# EAGLE design keyboard_s (EAGLE 7.2.0)
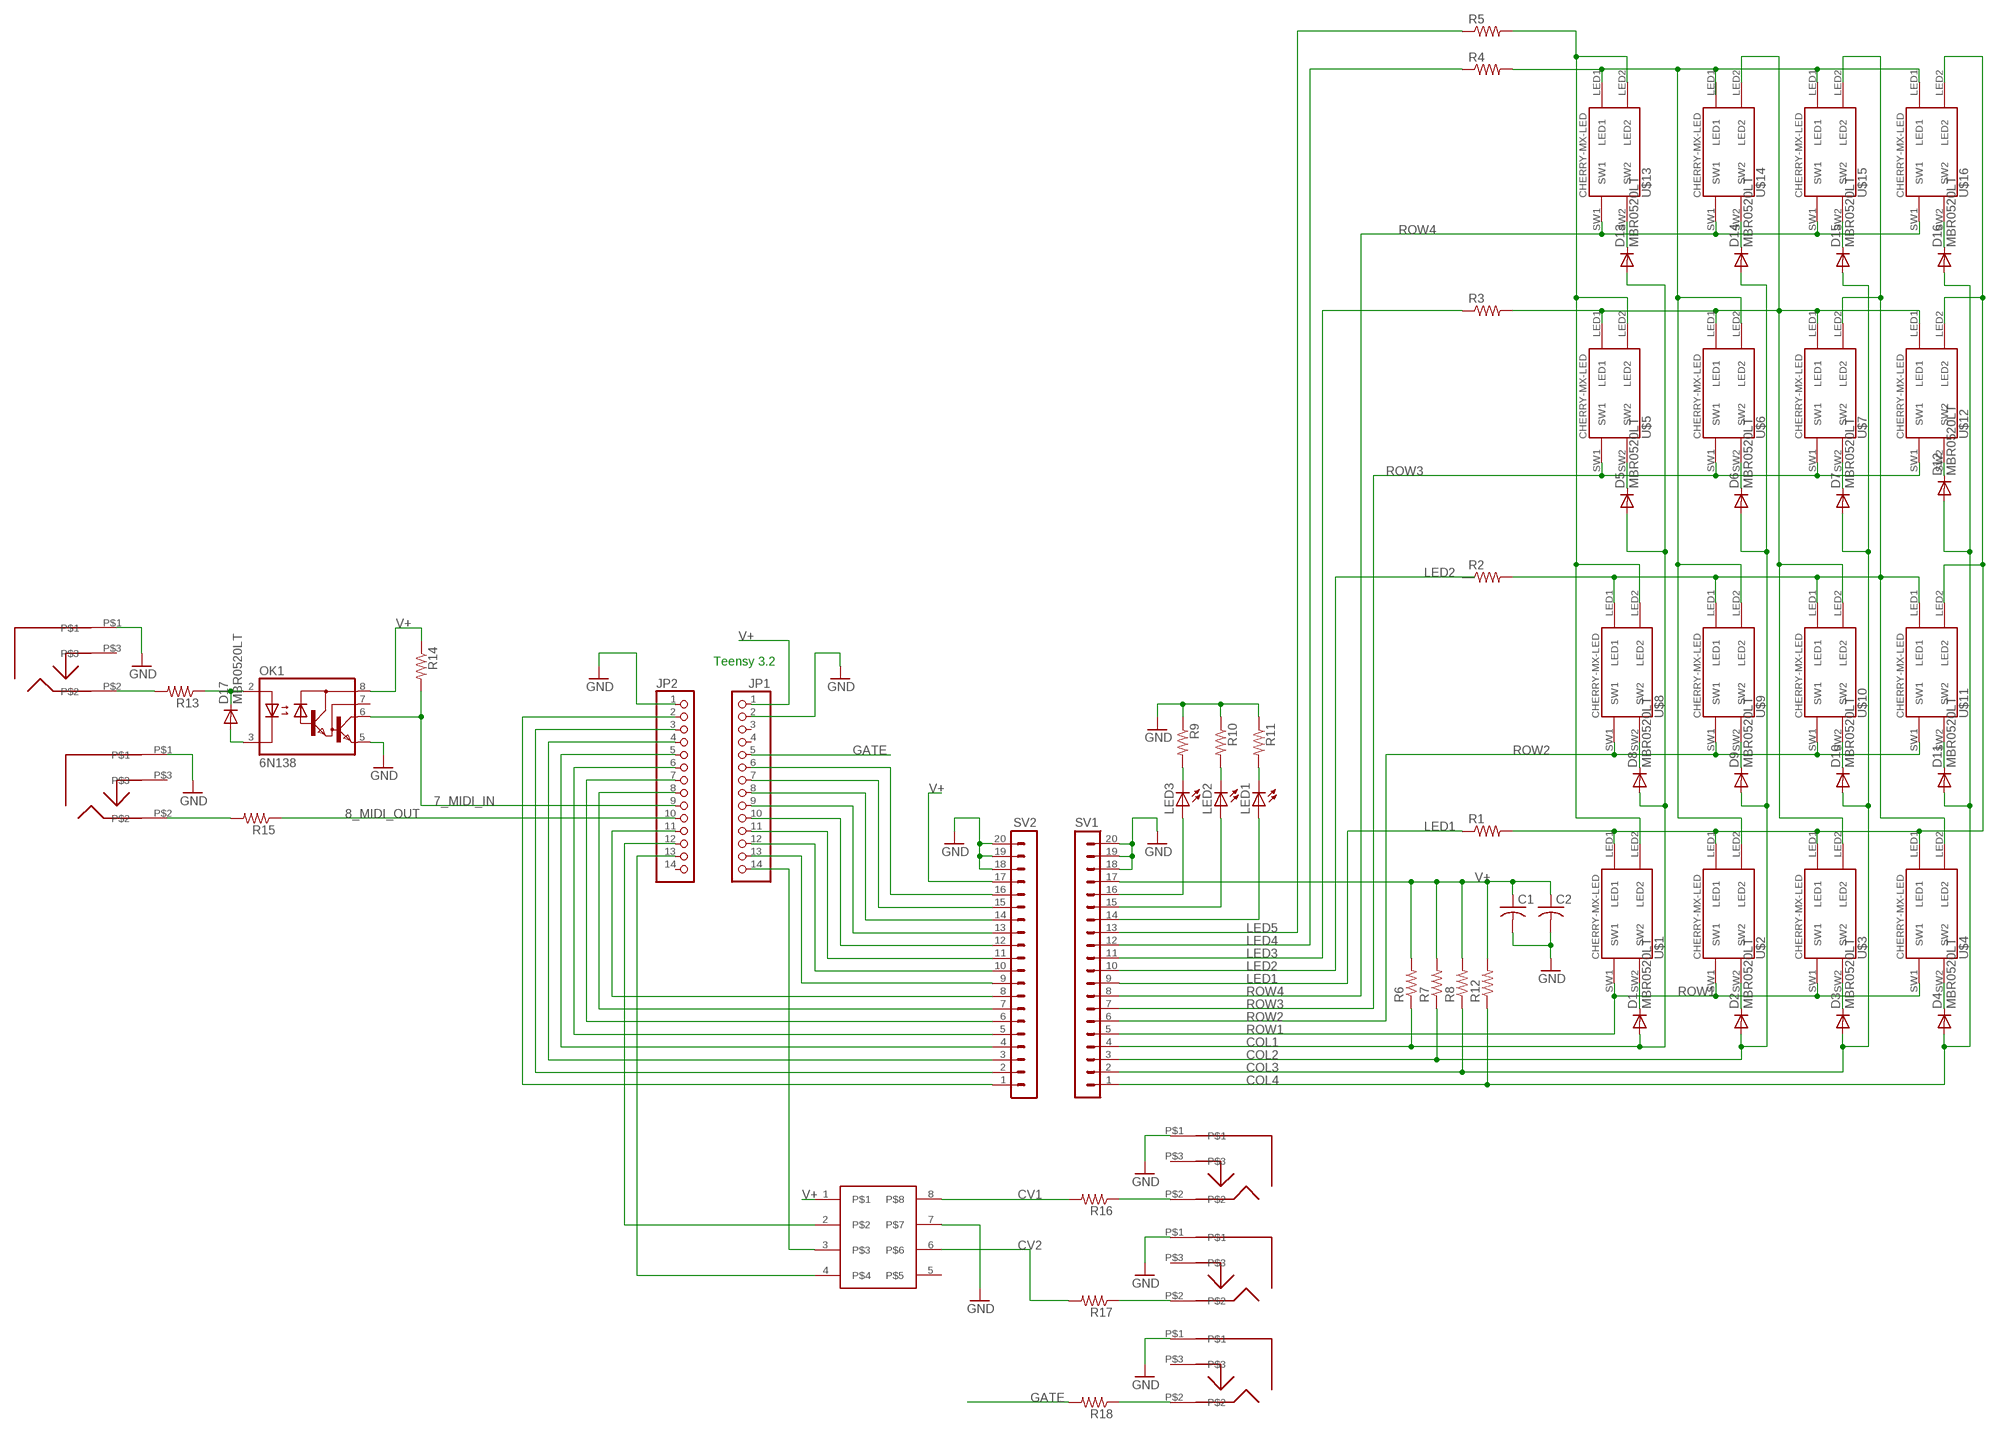
[diagram p0: schematic, sheet 1]

## Parts
C1  C-USC0603  [C0603]
C2  C-USC0603  [C0603]
D1  MBR0520LT  [SOD123]
D2  MBR0520LT  [SOD123]
D3  MBR0520LT  [SOD123]
D4  MBR0520LT  [SOD123]
D5  MBR0520LT  [SOD123]
D6  MBR0520LT  [SOD123]
D7  MBR0520LT  [SOD123]
D8  MBR0520LT  [SOD123]
D9  MBR0520LT  [SOD123]
D10  MBR0520LT  [SOD123]
D11  MBR0520LT  [SOD123]
D12  MBR0520LT  [SOD123]
D13  MBR0520LT  [SOD123]
D14  MBR0520LT  [SOD123]
D15  MBR0520LT  [SOD123]
D16  MBR0520LT  [SOD123]
D17  MBR0520LT  [SOD123]
JP1  PINHD-1X14  [1X14]
JP2  PINHD-1X14  [1X14]
LED1  LED5MM  [LED5MM]
LED2  LED5MM  [LED5MM]
LED3  LED5MM  [LED5MM]
OK1  6N138  [DIL08]
R1  R-US_R0603  [R0603]
R2  R-US_R0603  [R0603]
R3  R-US_R0603  [R0603]
R4  R-US_R0603  [R0603]
R5  R-US_R0603  [R0603]
R6  R-US_R0603  [R0603]
R7  R-US_R0603  [R0603]
R8  R-US_R0603  [R0603]
R9  R-US_R0603  [R0603]
R10  R-US_R0603  [R0603]
R11  R-US_R0603  [R0603]
R12  R-US_R0603  [R0603]
R13  R-US_R0603  [R0603]
R14  R-US_R0603  [R0603]
R15  R-US_R0603  [R0603]
R16  R-US_R0603  [R0603]
R17  R-US_R0603  [R0603]
R18  R-US_R0603  [R0603]
SV1  MA20-1  [MA20-1]
SV2  MA20-1  [MA20-1]
U$1  CHERRY-MX-LED  [CHERRY-MX-LED]
U$2  CHERRY-MX-LED  [CHERRY-MX-LED]
U$3  CHERRY-MX-LED  [CHERRY-MX-LED]
U$4  CHERRY-MX-LED  [CHERRY-MX-LED]
U$5  CHERRY-MX-LED  [CHERRY-MX-LED]
U$6  CHERRY-MX-LED  [CHERRY-MX-LED]
U$7  CHERRY-MX-LED  [CHERRY-MX-LED]
U$8  CHERRY-MX-LED  [CHERRY-MX-LED]
U$9  CHERRY-MX-LED  [CHERRY-MX-LED]
U$10  CHERRY-MX-LED  [CHERRY-MX-LED]
U$11  CHERRY-MX-LED  [CHERRY-MX-LED]
U$12  CHERRY-MX-LED  [CHERRY-MX-LED]
U$13  CHERRY-MX-LED  [CHERRY-MX-LED]
U$14  CHERRY-MX-LED  [CHERRY-MX-LED]
U$15  CHERRY-MX-LED  [CHERRY-MX-LED]
U$16  CHERRY-MX-LED  [CHERRY-MX-LED]
U$17  MCP4822  [SO08]
U$18  MJ3536N  [MJ3536N]
U$19  MJ3536N  [MJ3536N]
U$20  MJ3536N  [MJ3536N]
U$21  MJ3536N  [MJ3536N]
U$22  MJ3536N  [MJ3536N]

## Nets
7_MIDI_IN: JP2.9 OK1.6(VO) R14.2
8_MIDI_OUT: JP2.10 R15.1
COL1: D1.A D5.A D8.A D13.A R6.1 SV1.4
COL2: D2.A D6.A D9.A D14.A R7.1 SV1.3
COL3: D3.A D7.A D10.A D15.A R8.1 SV1.2
COL4: D4.A D11.A D12.A D16.A R12.1 SV1.1
CV1: R16.2 U$17.8
CV2: R17.2 U$17.6
GATE: JP1.5 R18.2
GND: C1.2 C2.2 JP1.2 JP2.1 OK1.5(GND) R9.1 R10.1 R11.1 SV1.18 SV1.19 SV1.20 SV2.18 SV2.19 SV2.20 U$17.7 U$18.P$1 U$19.P$1 U$20.P$1 U$21.P$1 U$22.P$1
LED1: R1.1 SV1.9
LED2: R2.1 SV1.10
LED3: R3.1 SV1.11
LED4: R4.1 SV1.12
LED5: R5.1 SV1.13
N$1: D8.C U$8.SW2
N$2: D9.C U$9.SW2
N$3: D10.C U$10.SW2
N$4: D11.C U$11.SW2
N$5: D12.C U$12.SW2
N$6: D13.C U$13.SW2
N$7: D14.C U$14.SW2
N$8: D7.C U$7.SW2
N$9: D6.C U$6.SW2
N$10: D5.C U$5.SW2
N$11: D4.C U$4.SW2
N$12: D3.C U$3.SW2
N$13: D2.C U$2.SW2
N$14: D1.C U$1.SW2
N$15: D15.C U$15.SW2
N$16: D16.C U$16.SW2
N$17: LED1.A SV1.14
N$18: D17.C OK1.2(A) R13.1
N$19: R1.2 U$1.LED1 U$2.LED1 U$3.LED1 U$4.LED1 U$11.LED2 U$12.LED2 U$16.LED2
N$20: D17.A OK1.3(C)
N$21: LED2.A SV1.15
N$22: LED3.A SV1.16
N$23: R13.2 U$18.P$2
N$24: JP1.14 U$17.3
N$25: JP2.13 U$17.4
N$26: JP2.12 U$17.2
N$27: JP2.2 SV2.1
N$28: JP2.3 SV2.2
N$29: JP2.4 SV2.3
N$30: JP2.5 SV2.4
N$31: JP2.6 SV2.5
N$32: JP2.7 SV2.6
N$33: JP2.8 SV2.7
N$34: JP2.11 SV2.8
N$35: JP1.13 SV2.9
N$36: JP1.12 SV2.10
N$37: JP1.11 SV2.11
N$38: JP1.10 SV2.12
N$39: JP1.9 SV2.13
N$40: JP1.8 SV2.14
N$41: JP1.7 SV2.15
N$42: JP1.6 SV2.16
N$43: R15.2 U$19.P$2
N$44: R16.1 U$20.P$2
N$45: R17.1 U$21.P$2
N$46: R18.1 U$22.P$2
N$48: LED1.K(C) R11.2
N$50: R3.2 U$3.LED2 U$5.LED1 U$6.LED1 U$7.LED1 U$10.LED2 U$12.LED1 U$14.LED2
N$51: R5.2 U$1.LED2 U$5.LED2 U$8.LED2 U$13.LED2
N$54: LED2.K(C) R10.2
N$55: LED3.K(C) R9.2
N$76: R4.2 U$2.LED2 U$6.LED2 U$9.LED2 U$13.LED1 U$15.LED1 U$16.LED1
N$113: R2.2 U$4.LED2 U$7.LED2 U$8.LED1 U$9.LED1 U$10.LED1 U$11.LED1 U$15.LED2
ROW1: SV1.5 U$1.SW1 U$2.SW1 U$3.SW1 U$4.SW1
ROW2: SV1.6 U$8.SW1 U$9.SW1 U$10.SW1 U$11.SW1
ROW3: SV1.7 U$5.SW1 U$6.SW1 U$7.SW1 U$12.SW1
ROW4: SV1.8 U$13.SW1 U$14.SW1 U$15.SW1 U$16.SW1
V+: C1.1 C2.1 JP1.1 OK1.8(VCC) R6.2 R7.2 R8.2 R12.2 R14.1 SV1.17 SV2.17
Unconnected: JP1.3 JP1.4 JP2.14 OK1.7(VB) U$14.LED1 U$17.1 U$17.5 U$18.P$3 U$19.P$3 U$20.P$3 U$21.P$3 U$22.P$3

## Notes on the sheet
- Teensy 3.2

## Library data of the parts
C1 C2 = dan:C-US: CAPACITOR, American symbol
D1-D17 = dan:MBR0520LT: SCHOTTKY BARRIER RECTIFIER Source: http://onsemi.com .. MBR0520LT1-D.pdf
JP1 JP2 = dan:PINHD-1X14: PIN HEADER
LED1-LED3 = dan:LED: LED OSRAM: - CHIPLED LG R971, LG N971, LY N971, LG Q971, LY Q971, LO R971, LY R971 LH N974, LH R974 LS Q976, LO Q976, LY Q976 LO Q996 - Hyper CHIPLED LW Q18S LB Q993, LB Q99A, LB R99A - SideLED LS A670, LO A670, LY A670, LG A670, LP A670 LB A673, LV A673, LT A673, LW A673 LH A674 LY A675 LS A676, LA A676, LO A676, LY A676, LW A676 LS A679, LY A679, LG A679 - Hyper Micro SIDELED® LS Y876, LA Y876, LO Y876, LY Y876 LT Y87S - SmartLED LW L88C, LW L88S LB L89C, LB L89S, LG L890 LS L89K, LO L89K, LY L89K LS L896, LA L896, LO L896, LY L896 - TOPLED LS T670, LO T670, LY T670, LG T670, LP T670 LSG T670, LSP T670, LSY T670, LOP T670, LYG T670 LG T671, LOG T671, LSG T671 LB T673, LV T673, LT T673, LW T673 LH T674 LS T676, LA T676, LO T676, LY T676, LB T676, LH T676, LSB T676, LW T676 LB T67C, LV T67C, LT T67C, LS T67K, LO T67K, LY T67K, LW E67C LS E67B, LA E67B, LO E67B, LY E67B, LB E67C, LV E67C, LT E67C LW T67C LS T679, LY T679, LG T679 LS T770, LO T770, LY T770, LG T770, LP T770 LB T773, LV T773, LT T773, LW T773 LH T774 LS E675, LA E675, LY E675, LS T675 LS T776, LA T776, LO T776, LY T776, LB T776 LHGB T686 LT T68C, LB T68C - Hyper Mini TOPLED® LB M676 - Mini TOPLED Santana® LG M470 LS M47K, LO M47K, LY M47K Source: http://www.osram.convergy.de LUXEON: - LUMILED® LXK2-PW12-R00, LXK2-PW12-S00, LXK2-PW14-U00, LXK2-PW14-V00 LXK2-PM12-R00, LXK2-PM12-S00, LXK2-PM14-U00 LXK2-PE12-Q00, LXK2-PE12-R00, LXK2-PE12-S00, LXK2-PE14-T00, LXK2-PE14-U00 LXK2-PB12-K00, LXK2-PB12-L00, LXK2-PB12-M00, LXK2-PB14-N00, LXK2-PB14-P00, LXK2-PB14-Q00 LXK2-PR12-L00, LXK2-PR12-M00, LXK2-PR14-Q00, LXK2-PR14-R00 LXK2-PD12-Q00, LXK2-PD12-R00, LXK2-PD12-S00 LXK2-PH12-R00, LXK2-PH12-S00 LXK2-PL12-P00, LXK2-PL12-Q00, LXK2-PL12-R00 Source: www.luxeon.com KINGBRIGHT: KA-3528ASYC Source: www.kingbright.com
OK1 = dan:6N138: MOTOROLA OPTO COUPLER; MF: VISHAY/TELEFUNKEN; MPN: 6N138; OC_FARNELL: 9860150; OC_NEWARK: 35K5294
R1-R18 = dan:R-US_: RESISTOR, American symbol
SV1 SV2 = dan:MA20-1: PIN HEADER; OC_FARNELL: unknown; OC_NEWARK: unknown
U$1-U$16 = dan:CHERRY-MX-LED: Cherry MX series keyswitch with LED
U$17 = dan:MCP4822
U$18-U$22 = dan:MJ3536N

## Board
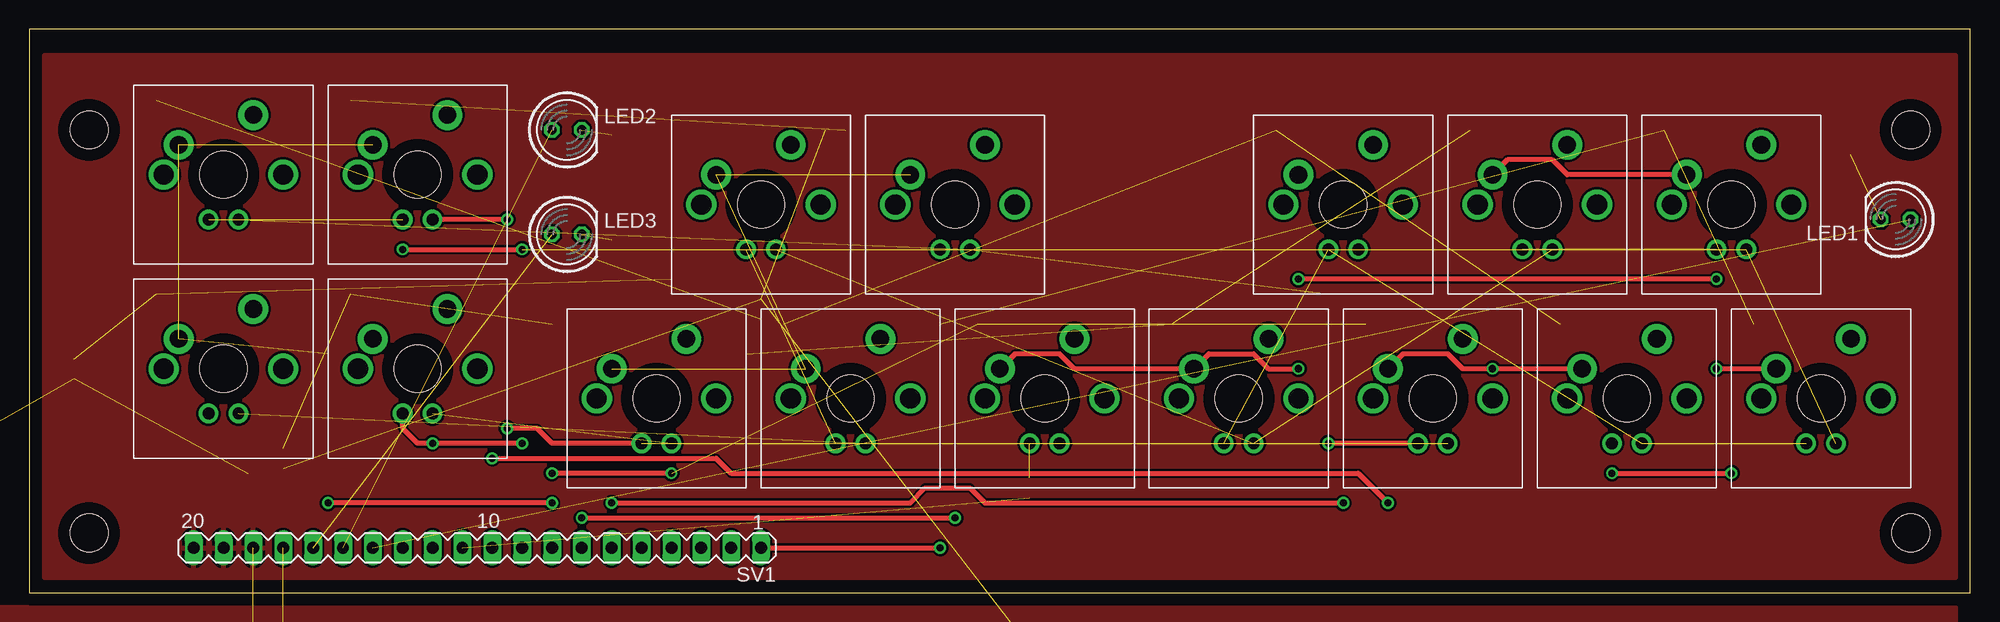
[diagram p1: board, top side]
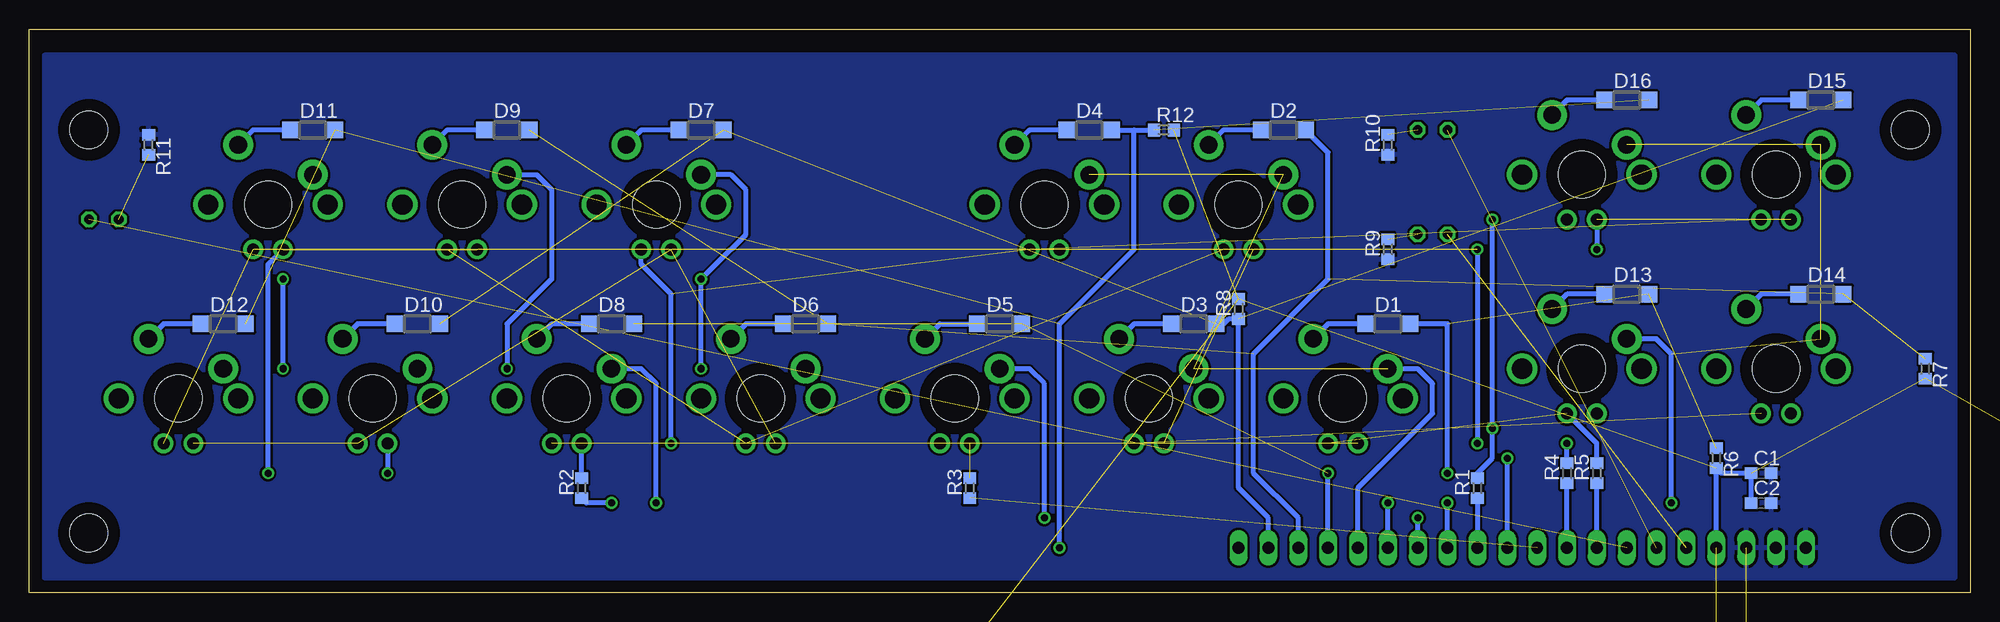
[diagram p2: board, bottom side, seen from below]

Size 165.08 x 47.93 mm. Coordinates in mm from the lower left corner, seen from the top.
Outline: 0,0 165.08,0 165.08,47.93 0,47.93 0,0
Copper layers (1*16): Top 0.035mm / dielectric 1.5mm / Bottom 0.035mm
Design rules "default": minimum track width 10mil, minimum drill 24mil, track to track 8mil, track to pad 8mil, pad to pad 8mil, via to via 8mil, smd to smd 8mil, copper to edge 40mil, drill to drill 8mil, minimum pad ring 10mil, minimum via ring 8mil, stop-mask expansion 4mil, vias tented up to drill 0mil, thermal gap 10mil
Holes 3.2 mm at 5.08,5.08 5.08,39.37 160.02,5.08 160.02,39.37 160.02,-40.64 160.02,-7.62 5.08,-7.62 5.08,-41.91

### Footprints (pad centres in the part's own frame; a part is rotated, then mirrored left to right if it is on the bottom)
C0603 = smd 1.1 x 1: 1 -0.85,0; 2 0.85,0
SOD123 = smd 1.4 x 1.4: A 1.9,0; C -1.9,0
1X14 = drill 1.016 long: 1 -16.51,0; 2 -13.97,0; 3 -11.43,0; 4 -8.89,0; 5 -6.35,0; 6 -3.81,0; 7 -1.27,0; 8 1.27,0; 9 3.81,0; 10 6.35,0; 11 8.89,0; 12 11.43,0; 13 13.97,0; 14 16.51,0
LED5MM = drill 0.813 octagon: A -1.27,0; K 1.27,0
DIL08 = drill 0.813 offset: 1 -3.81,-3.81; 2 -1.27,-3.81; 3 1.27,-3.81; 4 3.81,-3.81; 5 3.81,3.81; 6 1.27,3.81; 7 -1.27,3.81; 8 -3.81,3.81
R0603 = smd 1 x 1.1: 1 -0.85,0; 2 0.85,0
MA20-1 = drill 1.016 long: 1 -24.13,0; 2 -21.59,0; 3 -19.05,0; 4 -16.51,0; 5 -13.97,0; 6 -11.43,0; 7 -8.89,0; 8 -6.35,0; 9 -3.81,0; 10 -1.27,0; 11 1.27,0; 12 3.81,0; 13 6.35,0; 14 8.89,0; 15 11.43,0; 16 13.97,0; 17 16.51,0; 18 19.05,0; 19 21.59,0; 20 24.13,0
CHERRY-MX-LED = drill 1.016 pad 1.676: LED1 -1.27,-3.81; LED2 1.27,-3.81 | drill 1.714 pad 1.93: P$3 -5.08,0; P$4 5.08,0 | drill 1.5 pad 2.54: SW1 -3.81,2.54; SW2 2.54,5.08 | hole 4: 0,0
SO08 = smd 0.6 x 2.2: 1 -1.905,-2.6; 2 -0.635,-2.6; 3 0.635,-2.6; 4 1.905,-2.6; 5 1.905,2.6; 6 0.635,2.6; 7 -0.635,2.6; 8 -1.905,2.6
MJ3536N = drill 2.2 square: P$1 -11.43,0; P$2 2.54,0; P$3 0,-5.08

### Placement (x,y rotation side)
C1  17.78,10.16 0 bottom
C2  17.78,7.62 0 bottom
D1  49.53,22.86 0 bottom
D2  58.42,39.37 0 bottom
D3  66.04,22.86 0 bottom
D4  74.93,39.37 0 bottom
D5  82.55,22.86 0 bottom
D6  99.06,22.86 0 bottom
D7  107.95,39.37 0 bottom
D8  115.57,22.86 0 bottom
D9  124.46,39.37 0 bottom
D10  132.08,22.86 0 bottom
D11  140.97,39.37 0 bottom
D12  148.59,22.86 0 bottom
D13  29.21,25.4 0 bottom
D14  12.7,25.4 0 bottom
D15  12.7,41.91 0 bottom
D16  29.21,41.91 0 bottom
D17  91.44,-5.08 180 top  (outside the outline)
JP1  -31.75,-11.43 0 top  (outside the outline)
JP2  -31.75,-35.56 0 top  (outside the outline)
LED1  158.75,31.75 180 top
LED2  45.72,39.37 0 top
LED3  45.72,30.48 0 top
OK1  91.44,-13.97 180 top  (outside the outline)
R1  41.91,8.89 90 bottom
R2  118.11,8.89 90 bottom
R3  85.09,8.89 90 bottom
R4  34.29,10.16 90 bottom
R5  31.75,10.16 90 bottom
R6  21.59,11.43 270 bottom
R7  3.81,19.05 270 bottom
R8  62.23,24.13 90 bottom
R9  49.53,29.21 90 bottom
R10  49.53,38.1 90 bottom
R11  154.94,38.1 270 bottom
R12  68.58,39.37 0 bottom
R13  97.79,-5.08 0 top  (outside the outline)
R14  91.44,-22.86 180 top  (outside the outline)
R15  96.52,-22.86 270 top  (outside the outline)
R16  114.3,-22.86 90 top  (outside the outline)
R17  132.08,-22.86 90 top  (outside the outline)
R18  148.59,-22.86 90 top  (outside the outline)
SV1  38.1,3.81 180 top
SV2  38.1,-40.64 180 top  (outside the outline)
U$1  53.34,16.51 0 top
U$2  62.23,33.02 0 top
U$3  69.85,16.51 0 top
U$4  78.74,33.02 0 top
U$5  86.36,16.51 0 top
U$6  102.87,16.51 0 top
U$7  111.76,33.02 0 top
U$8  119.38,16.51 0 top
U$9  128.27,33.02 0 top
U$10  135.89,16.51 0 top
U$11  144.78,33.02 0 top
U$12  152.4,16.51 0 top
U$13  33.02,19.05 0 top
U$14  16.51,19.05 0 top
U$15  16.51,35.56 0 top
U$16  33.02,35.56 0 top
U$17  119.38,-11.43 180 top  (outside the outline)
U$18  77.47,-30.48 90 top  (outside the outline)
U$19  96.52,-30.48 90 top  (outside the outline)
U$20  114.3,-30.48 90 top  (outside the outline)
U$21  132.08,-30.48 90 top  (outside the outline)
U$22  148.59,-30.48 90 top  (outside the outline)

### Tracks (layer width: path | path; a pad name or v marks a point on that pad's centre or on a via)
7_MIDI_IN  (2 unrouted)
8_MIDI_OUT  (1 unrouted)
COL1  (via drill 0.6)  (4 unrouted)
  Top 0.406: v54.61,10.16 v44.45,10.16
  Bottom 0.406: SV1.4 v54.61,10.16 | v44.45,10.16 44.45,22.86 D1.A
COL2  (4 unrouted)
  Bottom 0.406: SV1.3 57.15,6.35 60.96,10.16 60.96,20.32 54.61,26.67 54.61,37.46 D2.A
COL3  (3 unrouted)
  Bottom 0.406: SV1.2 59.69,6.35 62.23,8.89 R8.1 63.08,23.28 63.5,22.86 D3.A
COL4  (via drill 0.6)  (3 unrouted)
  Top 0.406: SV1.1 v77.47,3.81
  Bottom 0.406: v77.47,3.81 77.47,22.86 71.12,29.21 71.12,39.37 | 71.12,39.37 R12.1 | D4.A 71.12,39.37
CV1  (1 unrouted)
CV2  (1 unrouted)
GATE  (1 unrouted)
GND  (1 unrouted)
  pour Top: 1.27,45.72 163.83,45.72 163.83,1.27 1.27,1.27
  pour Top: -62.23,-1.27 163.83,-1.27 163.83,-45.72 -62.23,-45.72
  pour Bottom: 1.27,45.72 163.83,45.72 163.83,1.27 1.27,1.27
LED1
  Bottom 0.406: R1.1 SV1.9
LED2  (via drill 0.6)
  Top 0.406: v39.37,11.43 58.42,11.43 59.69,10.16 113.03,10.16 v115.57,7.62
  Bottom 0.406: SV1.10 v39.37,11.43 | v115.57,7.62 117.69,7.62 R2.1
LED3  (1 unrouted)
LED4
  Bottom 0.406: SV1.12 R4.1
LED5
  Bottom 0.406: SV1.13 R5.1
N$1
  Bottom 0.406: D8.C 120.65,22.86 U$8.SW2
N$2
  Bottom 0.406: D9.C 129.54,39.37 U$9.SW2
N$3
  Bottom 0.406: D10.C 137.16,22.86 U$10.SW2
N$4
  Bottom 0.406: D11.C 146.05,39.37 U$11.SW2
N$5
  Bottom 0.406: D12.C 153.67,22.86 U$12.SW2
N$6
  Bottom 0.406: D13.C 34.29,25.4 U$13.SW2
N$7
  Bottom 0.406: D14.C 17.78,25.4 U$14.SW2
N$8
  Bottom 0.406: D7.C 113.03,39.37 U$7.SW2
N$9
  Bottom 0.406: D6.C 104.14,22.86 U$6.SW2
N$10
  Bottom 0.406: U$5.SW2 87.63,22.86 D5.C
N$11
  Bottom 0.406: D4.C 80.01,39.37 U$4.SW2
N$12
  Bottom 0.406: D3.C 71.12,22.86 U$3.SW2
N$13
  Bottom 0.406: D2.C 63.5,39.37 U$2.SW2
N$14
  Bottom 0.406: D1.C 54.61,22.86 U$1.SW2
N$15
  Bottom 0.406: D15.C 17.78,41.91 U$15.SW2
N$16
  Bottom 0.406: D16.C 34.29,41.91 U$16.SW2
N$17  (1 unrouted)
N$18  (2 unrouted)
N$19  (via drill 0.6)  (5 unrouted)
  Top 0.406: v40.64,31.75 U$16.LED2 | U$1.LED1 44.45,12.7 43.18,13.97 v40.64,13.97
  Bottom 0.406: R1.2 41.91,10.16 40.64,11.43 v40.64,13.97 40.64,15.24 v40.64,31.75
N$20  (1 unrouted)
N$21  (1 unrouted)
N$22  (1 unrouted)
N$23  (1 unrouted)
N$24  (1 unrouted)
N$25  (1 unrouted)
N$26  (1 unrouted)
N$27  (1 unrouted)
N$28  (1 unrouted)
N$29  (1 unrouted)
N$30  (1 unrouted)
N$31  (1 unrouted)
N$32  (1 unrouted)
N$33  (1 unrouted)
N$34  (1 unrouted)
N$35  (1 unrouted)
N$36  (1 unrouted)
N$37  (1 unrouted)
N$38  (1 unrouted)
N$39  (1 unrouted)
N$40  (1 unrouted)
N$41  (1 unrouted)
N$42  (1 unrouted)
N$43  (1 unrouted)
N$44  (1 unrouted)
N$45  (1 unrouted)
N$46  (1 unrouted)
N$48  (1 unrouted)
N$50  (7 unrouted)
N$51  (3 unrouted)
  Bottom 0.406: R5.2 31.75,12.7 U$13.LED2
N$54  (1 unrouted)
N$55  (1 unrouted)
N$76  (via drill 0.6)  (4 unrouted)
  Top 0.406: U$13.LED1 31.75,13.97 33.02,12.7 v34.29,12.7 v41.91,12.7 | v31.75,29.21 v41.91,29.21
  Bottom 0.406: R4.2 v34.29,12.7 | U$16.LED1 v31.75,29.21 | v41.91,29.21 v41.91,12.7
N$113  (via drill 0.6)  (4 unrouted)
  Top 0.406: U$8.LED1 v110.49,12.7 | v134.62,10.16 v144.78,10.16
  Bottom 0.406: R2.2 U$8.LED1 | v110.49,12.7 110.49,25.4 113.03,27.94 U$7.LED2 | U$10.LED1 v134.62,10.16 | v144.78,10.16 144.78,27.94 U$11.LED1
ROW1  (3 unrouted)
  Bottom 0.406: SV1.5 52.07,8.89 45.72,15.24 45.72,17.78 46.99,19.05 U$1.SW1
ROW2  (via drill 0.6)
  Top 0.406: U$10.SW1 v124.46,19.05 121.92,19.05 120.65,20.32 116.84,20.32 U$8.SW1 | U$11.SW1 130.81,35.56 129.54,36.83 125.73,36.83 U$9.SW1 | v49.53,7.62 74.93,7.62 76.2,8.89 80.01,8.89 81.28,7.62 v111.76,7.62
  Bottom 0.406: SV1.6 v49.53,7.62 | v111.76,7.62 111.76,17.78 113.03,19.05 U$8.SW1 | U$9.SW1 121.92,35.56 120.65,34.29 120.65,26.67 124.46,22.86 v124.46,19.05
ROW3  (via drill 0.6)
  Top 0.406: v46.99,6.35 v78.74,6.35 | U$5.SW1 83.82,20.32 87.63,20.32 88.9,19.05 U$6.SW1 100.33,20.32 104.14,20.32 105.41,19.05 v107.95,19.05 | U$12.SW1 v143.51,19.05 | v143.51,26.67 v107.95,26.67
  Bottom 0.406: SV1.7 v46.99,6.35 | v78.74,6.35 78.74,17.78 80.01,19.05 U$5.SW1 | v107.95,19.05 v107.95,26.67 106.68,27.94 104.14,30.48 104.14,34.29 105.41,35.56 U$7.SW1 | v143.51,19.05 v143.51,26.67
ROW4  (via drill 0.6)  (3 unrouted)
  Top 0.406: v44.45,7.62 v25.4,7.62
  Bottom 0.406: SV1.8 v44.45,7.62 | v25.4,7.62 25.4,20.32 26.67,21.59 U$13.SW1
V+  (7 unrouted)
  Bottom 0.406: SV1.17 R6.2 21.17,10.16 C1.1 C2.1